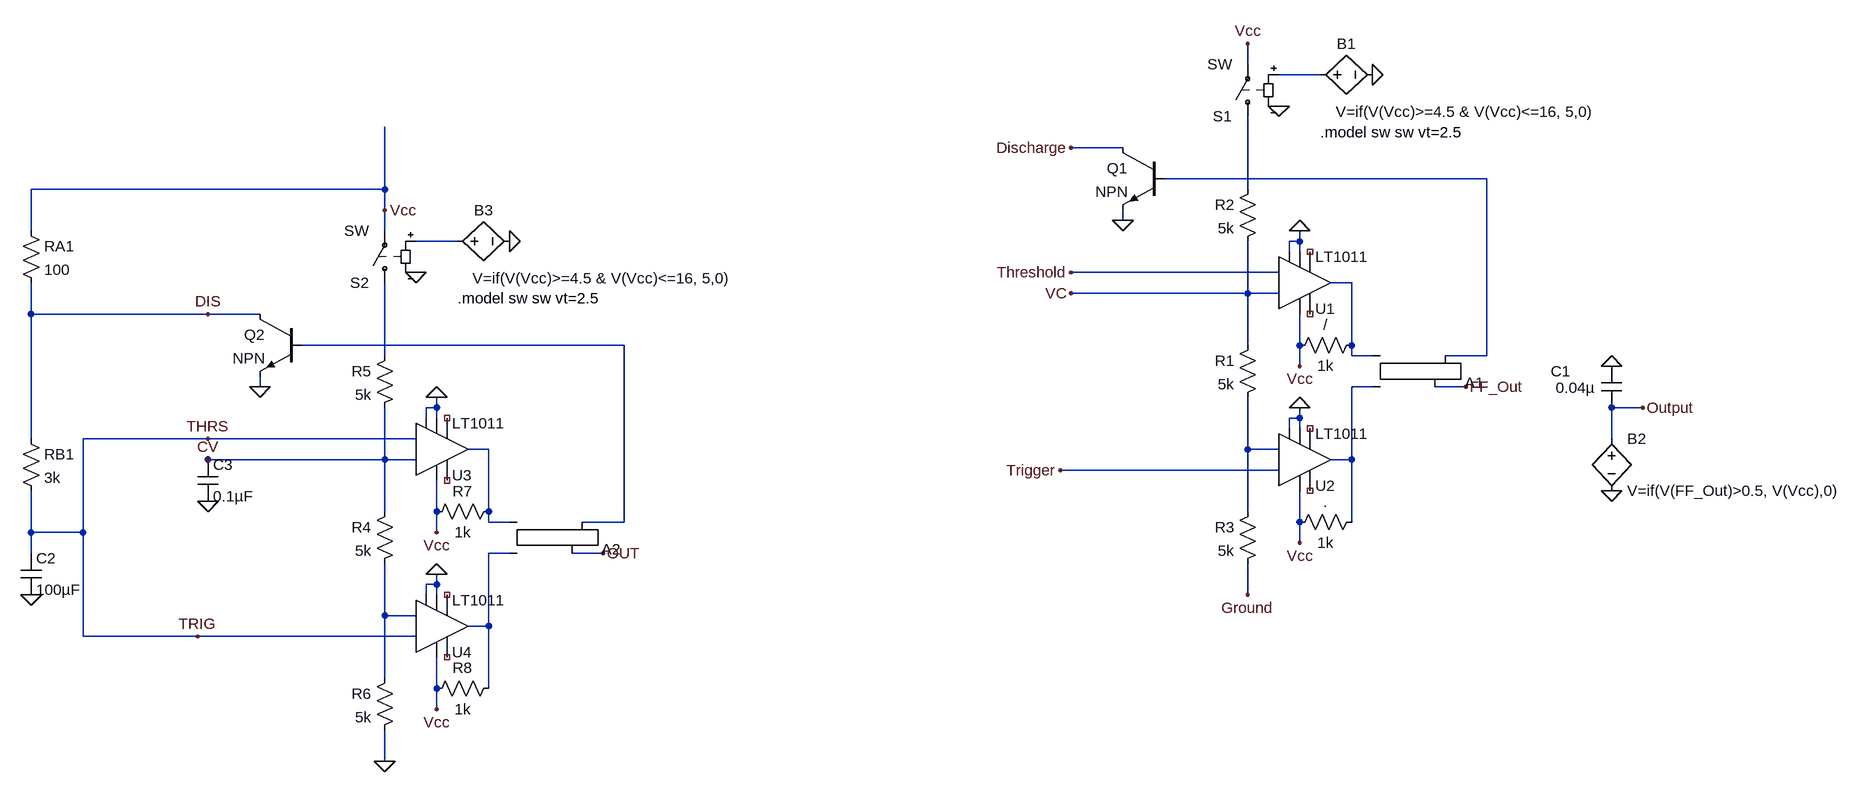
[diagram p0: schematic NE555 sch.asc]
NE555 sch.asc, the LTspice schematic file:
Version 4
SHEET 1 1596 720
WIRE -96 -368 -96 -400
WIRE 16 -352 -48 -352
WIRE -288 -240 -368 -240
WIRE 272 -192 -224 -192
WIRE -1424 -176 -1424 -272
WIRE -1424 -176 -1968 -176
WIRE -96 -176 -96 -288
WIRE -1424 -144 -1424 -176
WIRE -288 -128 -288 -144
WIRE -1968 -112 -1968 -176
WIRE -1424 -112 -1424 -144
WIRE -1312 -96 -1376 -96
WIRE -16 -96 -16 -112
WIRE -16 -96 -32 -96
WIRE -32 -80 -32 -96
WIRE -16 -80 -16 -96
WIRE -48 -48 -368 -48
WIRE 64 -32 32 -32
WIRE -96 -16 -96 -96
WIRE -96 -16 -368 -16
WIRE -48 -16 -96 -16
WIRE -1968 16 -1968 -32
WIRE -1696 16 -1968 16
WIRE -1616 16 -1696 16
WIRE -1056 64 -1552 64
WIRE -96 64 -96 -16
WIRE -16 64 -16 16
WIRE 64 64 64 -32
WIRE -1424 80 -1424 -32
WIRE 64 80 64 64
WIRE 96 80 64 80
WIRE 272 80 272 -192
WIRE 272 80 208 80
WIRE -16 96 -16 64
WIRE -1616 128 -1616 112
WIRE 96 128 64 128
WIRE 240 128 192 128
WIRE -1344 160 -1344 144
WIRE -1344 160 -1360 160
WIRE 512 160 464 160
WIRE -1360 176 -1360 160
WIRE -1344 176 -1344 160
WIRE -16 176 -16 160
WIRE -16 176 -32 176
WIRE -32 192 -32 176
WIRE -16 192 -16 176
WIRE -1968 208 -1968 16
WIRE -1696 208 -1888 208
WIRE -1376 208 -1696 208
WIRE 464 208 464 160
WIRE -1264 224 -1296 224
WIRE -96 224 -96 144
WIRE -48 224 -96 224
WIRE -1424 240 -1424 160
WIRE -1424 240 -1696 240
WIRE -1376 240 -1424 240
WIRE 64 240 64 128
WIRE 64 240 32 240
WIRE -1696 256 -1696 240
WIRE -48 256 -384 256
WIRE -1424 320 -1424 240
WIRE -1344 320 -1344 272
WIRE -1264 320 -1264 224
WIRE -96 320 -96 224
WIRE -1264 336 -1264 320
WIRE -1232 336 -1264 336
WIRE -1056 336 -1056 64
WIRE -1056 336 -1120 336
WIRE -16 336 -16 288
WIRE 64 336 64 240
WIRE -1968 352 -1968 288
WIRE -1888 352 -1888 208
WIRE -1888 352 -1968 352
WIRE -1344 352 -1344 320
WIRE -16 368 -16 336
WIRE -1968 384 -1968 352
WIRE -1232 384 -1264 384
WIRE -1088 384 -1136 384
WIRE -1344 432 -1344 416
WIRE -1344 432 -1360 432
WIRE -1360 448 -1360 432
WIRE -1344 448 -1344 432
WIRE -96 448 -96 400
WIRE -1424 480 -1424 400
WIRE -1376 480 -1424 480
WIRE -1264 496 -1264 384
WIRE -1264 496 -1296 496
WIRE -1888 512 -1888 352
WIRE -1712 512 -1888 512
WIRE -1376 512 -1712 512
WIRE -1424 576 -1424 480
WIRE -1344 592 -1344 544
WIRE -1264 592 -1264 496
WIRE -1344 624 -1344 592
WIRE -1424 704 -1424 656
FLAG -16 96 Vcc
FLAG -16 368 Vcc
FLAG -96 -400 Vcc
FLAG 512 160 Output
FLAG -368 -48 Threshold
FLAG -368 -240 Discharge
FLAG -384 256 Trigger
FLAG -368 -16 VC
FLAG -96 448 Ground
FLAG -16 -112 0
FLAG -16 160 0
FLAG -288 -128 0
FLAG -48 -304 0
FLAG 96 -352 0
FLAG 464 96 0
FLAG 464 288 0
FLAG 240 128 FF_Out
FLAG -1344 352 Vcc
FLAG -1344 624 Vcc
FLAG -1424 -144 Vcc
FLAG -1696 208 THRS
FLAG -1696 16 DIS
FLAG -1712 512 TRIG
FLAG -1696 240 CV
FLAG -1424 704 0
FLAG -1344 144 0
FLAG -1344 416 0
FLAG -1616 128 0
FLAG -1376 -48 0
FLAG -1232 -96 0
FLAG -1088 384 OUT
FLAG -1968 448 0
FLAG -1696 304 0
SYMBOL srflop 144 176 M180
SYMATTR InstName A1
SYMBOL LT1011 -16 -32 M180
SYMATTR InstName U1
SYMBOL LT1011 -16 240 M180
SYMATTR InstName U2
SYMBOL npn -224 -240 M0
SYMATTR InstName Q1
SYMBOL res -80 48 M0
SYMATTR InstName R1
SYMATTR Value 5k
SYMBOL res -80 -192 M0
SYMATTR InstName R2
SYMATTR Value 5k
SYMBOL res -80 304 M0
SYMATTR InstName R3
SYMATTR Value 5k
SYMBOL res 80 48 R90
WINDOW 0 0 56 VBottom 2
WINDOW 3 32 56 VTop 2
SYMATTR InstName /
SYMATTR Value 1k
SYMBOL res 80 320 R90
WINDOW 0 0 56 VBottom 2
WINDOW 3 32 56 VTop 2
SYMATTR InstName .
SYMATTR Value 1k
SYMBOL sw -96 -272 R180
SYMATTR InstName S1
SYMBOL bv 0 -352 R270
WINDOW 0 32 56 VTop 2
WINDOW 3 -41 238 VBottom 2
SYMATTR InstName B1
SYMATTR Value V=if(V(Vcc)>=4.5 & V(Vcc)<=16, 5,0)
SYMBOL cap 480 160 R180
WINDOW 0 79 56 Left 2
WINDOW 3 41 31 Left 2
SYMATTR InstName C1
SYMATTR Value 0.04µ
SYMBOL bv 464 192 R0
SYMATTR InstName B2
SYMATTR Value V=if(V(FF_Out)>0.5, V(Vcc),0)
SYMBOL srflop -1184 432 M180
SYMATTR InstName A2
SYMBOL LT1011 -1344 224 M180
SYMATTR InstName U3
SYMBOL LT1011 -1344 496 M180
SYMATTR InstName U4
SYMBOL npn -1552 16 M0
SYMATTR InstName Q2
SYMBOL res -1408 304 M0
SYMATTR InstName R4
SYMATTR Value 5k
SYMBOL res -1408 64 M0
SYMATTR InstName R5
SYMATTR Value 5k
SYMBOL res -1408 560 M0
SYMATTR InstName R6
SYMATTR Value 5k
SYMBOL res -1248 304 R90
WINDOW 0 0 56 VBottom 2
WINDOW 3 32 56 VTop 2
SYMATTR InstName R7
SYMATTR Value 1k
SYMBOL res -1248 576 R90
WINDOW 0 0 56 VBottom 2
WINDOW 3 32 56 VTop 2
SYMATTR InstName R8
SYMATTR Value 1k
SYMBOL sw -1424 -16 R180
SYMATTR InstName S2
SYMBOL bv -1328 -96 R270
WINDOW 0 32 56 VTop 2
WINDOW 3 -41 238 VBottom 2
SYMATTR InstName B3
SYMATTR Value V=if(V(Vcc)>=4.5 & V(Vcc)<=16, 5,0)
SYMBOL res -1984 192 R0
SYMATTR InstName RB1
SYMATTR Value 3k
SYMBOL Cap -1984 384 R0
SYMATTR InstName C2
SYMATTR Value 100µF
SYMBOL Res -1984 -128 R0
SYMATTR InstName RA1
SYMATTR Value 100
SYMBOL Cap -1712 240 R0
SYMATTR InstName C3
SYMATTR Value 0.1µF
TEXT 16 -264 Left 2 !.model sw sw vt=2.5
TEXT -1312 -8 Left 2 !.model sw sw vt=2.5

The netlist it stands for:
* NE555 sch.asc
A1 N008 N005 0 0 0 N002 FF_Out 0 SRFLOP
XU1 0 Threshold VC 0 NC_01 NC_02 N005 Vcc LT1011
XU2 0 N010 Trigger 0 NC_03 NC_04 N008 Vcc LT1011
Q1 Discharge N002 0 0 NPN
R1 VC N010 5k
R2 N003 VC 5k
R3 N010 Ground 5k
R§/ N005 Vcc 1k
R§. N008 Vcc 1k
S1 N003 Vcc N001 0 SW
B1 N001 0 V=if(V(Vcc)>=4.5 & V(Vcc)<=16, 5,0)
C1 Output 0 0.04µ
B2 Output 0 V=if(V(FF_Out)>0.5, V(Vcc),0)
A2 N011 N009 0 0 0 N006 OUT 0 SRFLOP
XU3 0 TRIG CV 0 NC_05 NC_06 N009 Vcc LT1011
XU4 0 N012 TRIG 0 NC_07 NC_08 N011 Vcc LT1011
Q2 DIS N006 0 0 NPN
R4 CV N012 5k
R5 N007 CV 5k
R6 N012 0 5k
R7 N009 Vcc 1k
R8 N011 Vcc 1k
S2 N007 Vcc N004 0 SW
B3 N004 0 V=if(V(Vcc)>=4.5 & V(Vcc)<=16, 5,0)
RB1 DIS TRIG 3k
C2 TRIG 0 100µF
RA1 Vcc DIS 100
C3 CV 0 0.1µF
.model NPN NPN
.model PNP PNP
.lib standard.bjt
.model sw sw vt=2.5
.model sw sw vt=2.5
.lib LTC1.lib
.backanno
.end